# EAGLE schematic TouchPanel_ver _4 (EAGLE 6.1)
Master board. Prototype version 1.0
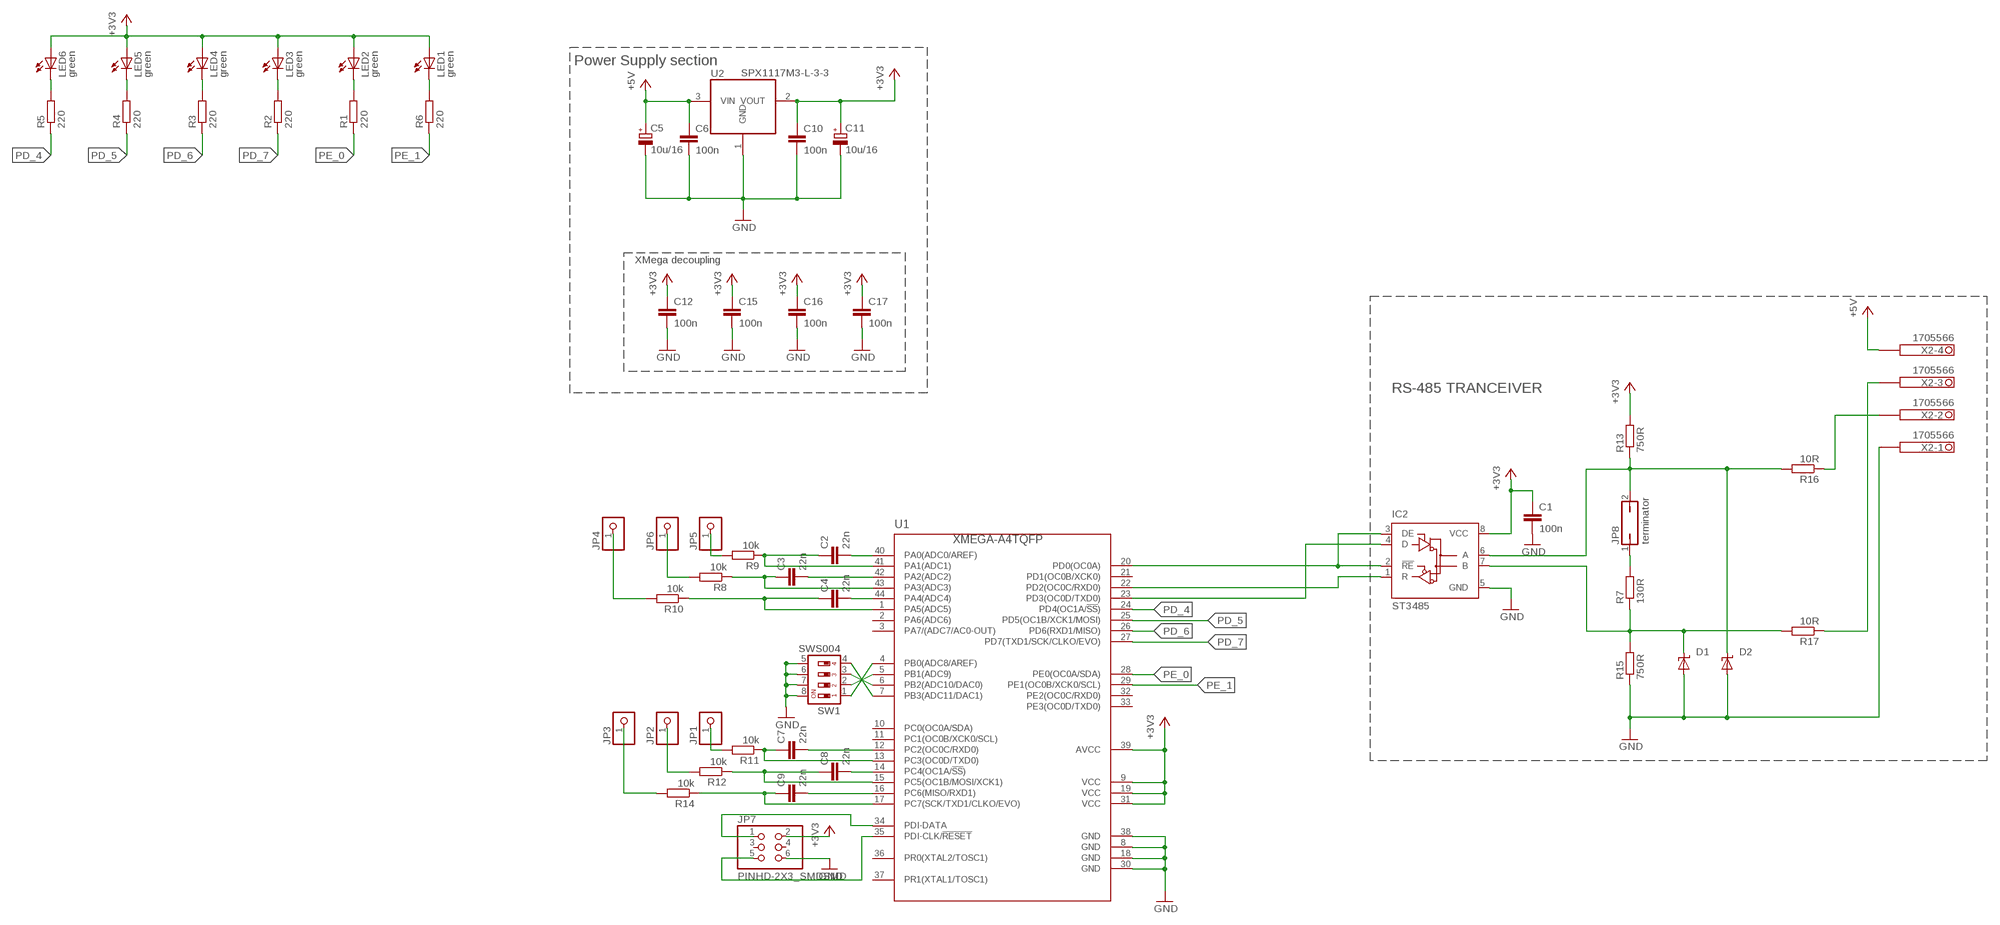
[diagram p0: schematic, sheet 1]

## Parts
C1  100n  C-EUC1206  [C1206]
C2  22n  C-EUC1206  [C1206]
C3  22n  C-EUC1206  [C1206]
C4  22n  C-EUC1206  [C1206]
C5  10u/16  CPOL-EUSMCB  [SMC_B]
C6  100n  C-EUC1206  [C1206]
C7  22n  C-EUC1206  [C1206]
C8  22n  C-EUC1206  [C1206]
C9  22n  C-EUC1206  [C1206]
C10  100n  C-EUC1206  [C1206]
C11  10u/16  CPOL-EUSMCB  [SMC_B]
C12  100n  C-EUC1206  [C1206]
C15  100n  C-EUC1206  [C1206]
C16  100n  C-EUC1206  [C1206]
C17  100n  C-EUC1206  [C1206]
D1  SUPPRESSOR-SMBJ  [SMBJ]
D2  SUPPRESSOR-SMBJ  [SMBJ]
IC2  ST3485  75176AD  [D_R-PDSO-G8]
JP1  PINHD-1X1  [1X01]
JP2  PINHD-1X1  [1X01]
JP3  PINHD-1X1  [1X01]
JP4  PINHD-1X1  [1X01]
JP5  PINHD-1X1  [1X01]
JP6  PINHD-1X1  [1X01]
JP7  PINHD-2X3_SMDSMD  [2X03_SMD]
JP8  terminator  JP1Q  [JP1]
LED1  green  LEDTOPLED-SANTANA  [MINI-TOPLED-SANTANA]
LED2  green  LEDTOPLED-SANTANA  [MINI-TOPLED-SANTANA]
LED3  green  LEDTOPLED-SANTANA  [MINI-TOPLED-SANTANA]
LED4  green  LEDTOPLED-SANTANA  [MINI-TOPLED-SANTANA]
LED5  green  LEDTOPLED-SANTANA  [MINI-TOPLED-SANTANA]
LED6  green  LEDTOPLED-SANTANA  [MINI-TOPLED-SANTANA]
R1  220  R-EU_M1206  [M1206]
R2  220  R-EU_M1206  [M1206]
R3  220  R-EU_R1206  [R1206]
R4  220  R-EU_R1206  [R1206]
R5  220  R-EU_R1206  [R1206]
R6  220  R-EU_M1206  [M1206]
R7  130R  R-EU_M1206  [M1206]
R8  10k  R-EU_R1206  [R1206]
R9  10k  R-EU_R1206  [R1206]
R10  10k  R-EU_R1206  [R1206]
R11  10k  R-EU_R1206  [R1206]
R12  10k  R-EU_R1206  [R1206]
R13  750R  R-EU_M1206  [M1206]
R14  10k  R-EU_R1206  [R1206]
R15  750R  R-EU_M1206  [M1206]
R16  10R  R-EU_M1206  [M1206]
R17  10R  R-EU_M1206  [M1206]
SW1  SWS004  [SMS-004]
U1  XMEGA-A4TQFP  [TQFP44]
U2  SPX1117M3-L-3-3  REG1117  [SOT223]
X2  1705566  [1705566]

## Nets
+3V3: C1.1 C10.1 C11.+ C12.1 C15.1 C16.1 C17.1 IC2.8(VCC) JP7.2 LED1.A LED2.A LED3.A LED4.A LED5.A LED6.A R13.2 U1.9(VCC) U1.19(VCC) U1.31(VCC) U1.39(AVCC) U2.2(VOUT)
+5V: C5.+ C6.1 U2.3(VIN) X2.4.2(-4:1B)
GND: C1.2 C5.- C6.2 C10.2 C11.- C12.2 C15.2 C16.2 C17.2 D1.A D2.A IC2.5(GND) JP7.6 R15.1 SW1.5 SW1.6 SW1.7 SW1.8 U1.8(GND) U1.18(GND) U1.30(GND) U1.38(GND) U2.1(GND) X2.1.2(-1:1B)
JP1: JP1.1 R11.2
JP2: JP2.1 R12.2
JP3: JP3.1 R14.2
JP4: JP4.1 R10.2
JP5: JP5.1 R9.2
JP6: JP6.1 R8.2
N$1: LED2.C R1.2
N$2: LED3.C R2.2
N$3: LED4.C R3.2
N$4: LED5.C R4.2
N$5: LED6.C R5.2
N$6: R17.1 X2.3.2(-3:1B)
N$7: JP8.1 R7.2
N$8: R16.1 X2.2.2(-2:1B)
N$9: D1.C IC2.7(B) R7.1 R15.2 R17.2
N$10: JP7.1 U1.34(PDI-DATA)
N$11: JP7.5 U1.35(PDI-CLK/!RESET)
N$12: LED1.C R6.2
N$13: C2.1 R9.1 U1.41(PA1(ADC1))
N$14: C2.2 U1.40(PA0(ADC0/AREF))
N$15: C9.2 U1.16(PC6(MISO/RXD1))
N$16: C3.1 R8.1 U1.43(PA3(ADC3))
N$17: C8.2 U1.14(PC4(OC1A/!SS!))
N$18: C4.1 R10.1 U1.1(PA5(ADC5))
N$20: C7.2 U1.12(PC2(OC0C/RXD0))
N$21: C9.1 R14.1 U1.17(PC7(SCK/TXD1/CLKO/EVO))
N$22: SW1.1 U1.4(PB0(ADC8/AREF))
N$23: SW1.4 U1.7(PB3(ADC11/DAC1))
N$24: SW1.2 U1.5(PB1(ADC9))
N$25: SW1.3 U1.6(PB2(ADC10/DAC0))
N$26: C8.1 R12.1 U1.15(PC5(OC1B/MOSI/XCK1))
N$27: C3.2 U1.42(PA2(ADC2))
N$28: C7.1 R11.1 U1.13(PC3(OC0D/TXD0))
N$29: C4.2 U1.44(PA4(ADC4))
PD_0: IC2.2(!RE) IC2.3(DE) U1.20(PD0(OC0A))
PD_2: IC2.1(R) U1.22(PD2(OC0C/RXD0))
PD_3: IC2.4(D) U1.23(PD3(OC0D/TXD0))
PD_4: R5.1 U1.24(PD4(OC1A/!SS!))
PD_5: R4.1 U1.25(PD5(OC1B/XCK1/MOSI))
PD_6: R3.1 U1.26(PD6(RXD1/MISO))
PD_7: R2.1 U1.27(PD7(TXD1/SCK/CLKO/EVO))
PE_0: R1.1 U1.28(PE0(OC0A/SDA))
PE_1: R6.1 U1.29(PE1(OC0B/XCK0/SCL))
RS485_A1: D2.C IC2.6(A) JP8.2 R13.1 R16.2
Unconnected: JP7.3 JP7.4 U1.2(PA6(ADC6)) U1.3(PA7/(ADC7/AC0-OUT)) U1.10(PC0(OC0A/SDA)) U1.11(PC1(OC0B/XCK0/SCL)) U1.21(PD1(OC0B/XCK0)) U1.32(PE2(OC0C/RXD0)) U1.33(PE3(OC0D/TXD0)) U1.36(PR0(XTAL2/TOSC1)) U1.37(PR1(XTAL1/TOSC1)) X2.1.1(-1:1A) X2.2.1(-2:1A) X2.3.1(-3:1A) X2.4.1(-4:1A)

## Notes on the sheet
- Power Supply section
- XMega decoupling
- RS-485 TRANCEIVER

## Library data of the parts
C1-C4 C6-C10 C12 C15-C17 = rcl:C-EU: CAPACITOR, European symbol
C5 C11 = rcl:CPOL-EU: POLARIZED CAPACITOR, European symbol
D1 D2 = diode:SUPPRESSOR-: Suppressor diode
IC2 = 751xx:75176A: DIFFERENTIAL BUS TRANSCEIVER Source: http://focus.ti.com/lit/ds/symlink/sn75176a.pdf
JP1-JP6 = pinhead:PINHD-1X1: PIN HEADER
JP7 = pinhead:PINHD-2X3_SMD
JP8 = jumper:JP1Q: JUMPER
LED1-LED6 = led:LED: LED OSRAM: - CHIPLED LG R971, LG N971, LY N971, LG Q971, LY Q971, LO R971, LY R971 LH N974, LH R974 LS Q976, LO Q976, LY Q976 LO Q996 - Hyper CHIPLED LW Q18S LB Q993, LB Q99A, LB R99A - SideLED LS A670, LO A670, LY A670, LG A670, LP A670 LB A673, LV A673, LT A673, LW A673 LH A674 LY A675 LS A676, LA A676, LO A676, LY A676, LW A676 LS A679, LY A679, LG A679 - Hyper Micro SIDELED® LS Y876, LA Y876, LO Y876, LY Y876 LT Y87S - SmartLED LW L88C, LW L88S LB L89C, LB L89S, LG L890 LS L89K, LO L89K, LY L89K LS L896, LA L896, LO L896, LY L896 - TOPLED LS T670, LO T670, LY T670, LG T670, LP T670 LSG T670, LSP T670, LSY T670, LOP T670, LYG T670 LG T671, LOG T671, LSG T671 LB T673, LV T673, LT T673, LW T673 LH T674 LS T676, LA T676, LO T676, LY T676, LB T676, LH T676, LSB T676, LW T676 LB T67C, LV T67C, LT T67C, LS T67K, LO T67K, LY T67K, LW E67C LS E67B, LA E67B, LO E67B, LY E67B, LB E67C, LV E67C, LT E67C LW T67C LS T679, LY T679, LG T679 LS T770, LO T770, LY T770, LG T770, LP T770 LB T773, LV T773, LT T773, LW T773 LH T774 LS E675, LA E675, LY E675, LS T675 LS T776, LA T776, LO T776, LY T776, LB T776 LHGB T686 LT T68C, LB T68C - Hyper Mini TOPLED® LB M676 - Mini TOPLED Santana® LG M470 LS M47K, LO M47K, LY M47K Source: http://www.osram.convergy.de LUXEON: - LUMILED® LXK2-PW12-R00, LXK2-PW12-S00, LXK2-PW14-U00, LXK2-PW14-V00 LXK2-PM12-R00, LXK2-PM12-S00, LXK2-PM14-U00 LXK2-PE12-Q00, LXK2-PE12-R00, LXK2-PE12-S00, LXK2-PE14-T00, LXK2-PE14-U00 LXK2-PB12-K00, LXK2-PB12-L00, LXK2-PB12-M00, LXK2-PB14-N00, LXK2-PB14-P00, LXK2-PB14-Q00 LXK2-PR12-L00, LXK2-PR12-M00, LXK2-PR14-Q00, LXK2-PR14-R00 LXK2-PD12-Q00, LXK2-PD12-R00, LXK2-PD12-S00 LXK2-PH12-R00, LXK2-PH12-S00 LXK2-PL12-P00, LXK2-PL12-Q00, LXK2-PL12-R00 Source: www.luxeon.com KINGBRIGHT: KA-3528ASYC Source: www.kingbright.com
R1-R17 = rcl:R-EU_: RESISTOR, European symbol
SW1 = smd-special:SWS004: SMD Dip Switch 4 pol.
U1 = avr-7:XMEGA-A4: Atmel XMega A4 series processor
U2 = burr-brown:REG1117: 800mA and 1A Low Dropout (LDO) Positive Regulator 1.8V, 2.5V, 2.85V, 3.3V, 5V, and Adj; MPN: REG1117; OC_FARNELL: 1097566; OC_NEWARK: 14P6981
X2 = con-phoenix-3.81:1705566: MKDSD 1,5/ 4-3,81 Printklemme Nennstrom: 8 A Bemessungsspannung: 200 V Raster: 3,81 mm Polzahl: 4 Montageart: Löten Anschlussart: Schraubanschluss Anschlussrichtung vom Leiter zur Platine: 0° Source: http://eshop.phoenixcontact.com .. 1705566.pdf; OC_FARNELL: unknown; OC_NEWARK: unknown